# Altium schematic sheet Relay Module.SchDoc: Title
size A4; Date: *******; ApprovedBy: *******; CheckedBy: None; Author: *******; CompanyName: *******; DrawnBy: Name; Engineer: *******; Organization: *******; Address1: *******; Address2: *******; Address3: *******; Address4: *******; DocumentNumber: Doc Num; Revision: *******; SheetNumber: 2; SheetTotal: 2; Subtitle: Subtitle; Project: Project; VersionRevision: VersionRevision; TotalSheet: TotalSheet; CurrentTime: *******; CurrentDate: *******; Time: *******; DocumentFullPathAndName: *******; DocumentName: *******; ModifiedDate: *******; ImagePath: *******; ProjectName: *******; Application_BuildNumber: *******
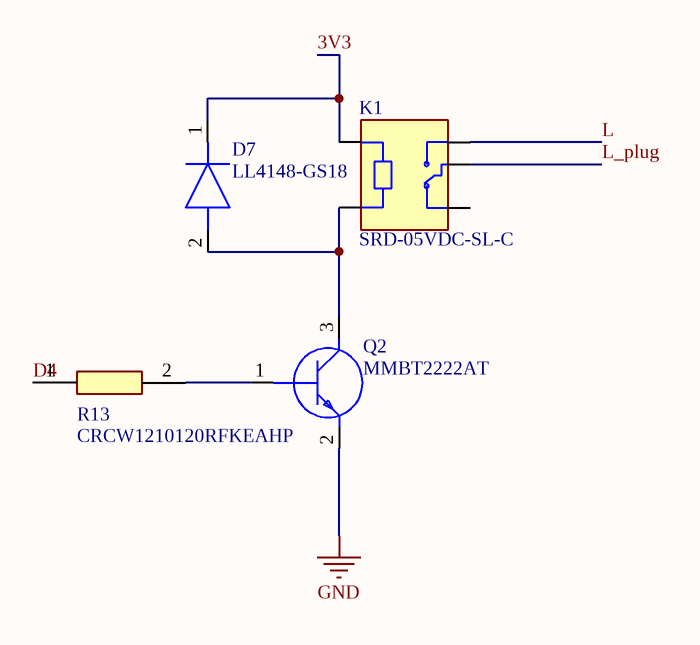
[diagram p0: Relay Module.SchDoc]

## Parts
D7  LL4148-GS18  [SOD-80]
K1  SRD-05VDC-SL-C  [RELAY_SRD-05VDC-SL-C]
Q2  MMBT2222AT  [SOTFL50P160X78-3N]
R13  CRCW1210120RFKEAHP  [RESC3225X70N]

## Nets
GND: Q2.2(E)
3V3: D7.1(K) K1.A1
D4: R13.1
L: K1.NO
L_plug: K1.COM
NetD7_2: D7.2(A) K1.A2 Q2.3(C)
NetQ2_1: Q2.1(B) R13.2

Not connected (* = marked no-connect by the designer): K1 NC

## Notes on the sheet
- Title:
- Drawn By:
- Page Contents:
- Checked By:
- Subtitle:
- University Of Moratuwa
- Moratuwa
- Size:
- Date:
- File:
- Email:
- A4
- lasithnawanjaan123@gmail.com
- Lasith Haputhanthri
- Number:
- Time:
- Revision:
- Sheet
- of
- Katubedda
- 10500
- Sri Lanka

## Library data of the parts
D7 = LL4148-GS18: Diode; Manufacturer_Name: Vishay; Datasheet Link: https://www.vishay.com/docs/85557/ll4148.pdf; Manufacturer_Part_Number: LL4148-GS18; Mouser Part Number: 78-LL4148-GS18; Mouser Price/Stock: https://www.mouser.co.uk/ProductDetail/Vishay-Semiconductors/LL4148-GS18?qs=YkIJFe%252BtFEUsKqcD4T1jvg%3D%3D; Arrow Part Number: LL4148-GS18; Arrow Price/Stock: https://www.arrow.com/en/products/ll4148-gs18/vishay?region=europe
K1 = SRD-05VDC-SL-C: 5V Trigger Relay Module For Arduino And Raspberry Pi 5V Trigger Relay Module For Arduino And Raspberry Pi; MF: Songle Relay; Check_prices: https://www.snapeda.com/parts/SRD-05VDC-SL-C/Songle+Relay/view-part/?ref=eda; Value: *; Availability: Not in stock; Price: None; Package: NON STANDARD-5 Songle Relay; MP: SRD-05VDC-SL-C; SnapEDA_Link: https://www.snapeda.com/parts/SRD-05VDC-SL-C/Songle+Relay/view-part/?ref=snap
Q2 = MMBT2222AT: Transistor BJT NPN; Manufacturer_Name: onsemi; Datasheet Link: http://www.onsemi.com/pub/Collateral/MMBT2222ATT1-D.PDF; Height: 0.78mm; Manufacturer_Part_Number: MMBT2222AT; Mouser Part Number: 512-MMBT2222AT; Mouser Price/Stock: https://www.mouser.co.uk/ProductDetail/ON-Semiconductor-Fairchild/MMBT2222AT/?qs=olBtUnqRSekpPcGAXqyohQ%3D%3D; Arrow Part Number: MMBT2222AT; Arrow Price/Stock: https://www.arrow.com/en/products/mmbt2222at/on-semiconductor
R13 = CRCW1210120RFKEAHP: Resistor; Manufacturer_Name: Vishay; Datasheet Link: http://componentsearchengine.com/Datasheets/1/CRCW1210120RFKEAHP.pdf; Height: 0.7mm; Manufacturer_Part_Number: CRCW1210120RFKEAHP; Mouser Part Number: 71-CRCW1210120RFKEAH; Mouser Price/Stock: https://www.mouser.co.uk/ProductDetail/Vishay-Dale/CRCW1210120RFKEAHP?qs=OAzHGkhREL38%2FX7kAmU4KQ%3D%3D; Arrow Part Number: CRCW1210120RFKEAHP; Arrow Price/Stock: https://www.arrow.com/en/products/crcw1210120rfkeahp/vishay?region=nac